# EAGLE design Focuser (EAGLE 7.0.0)
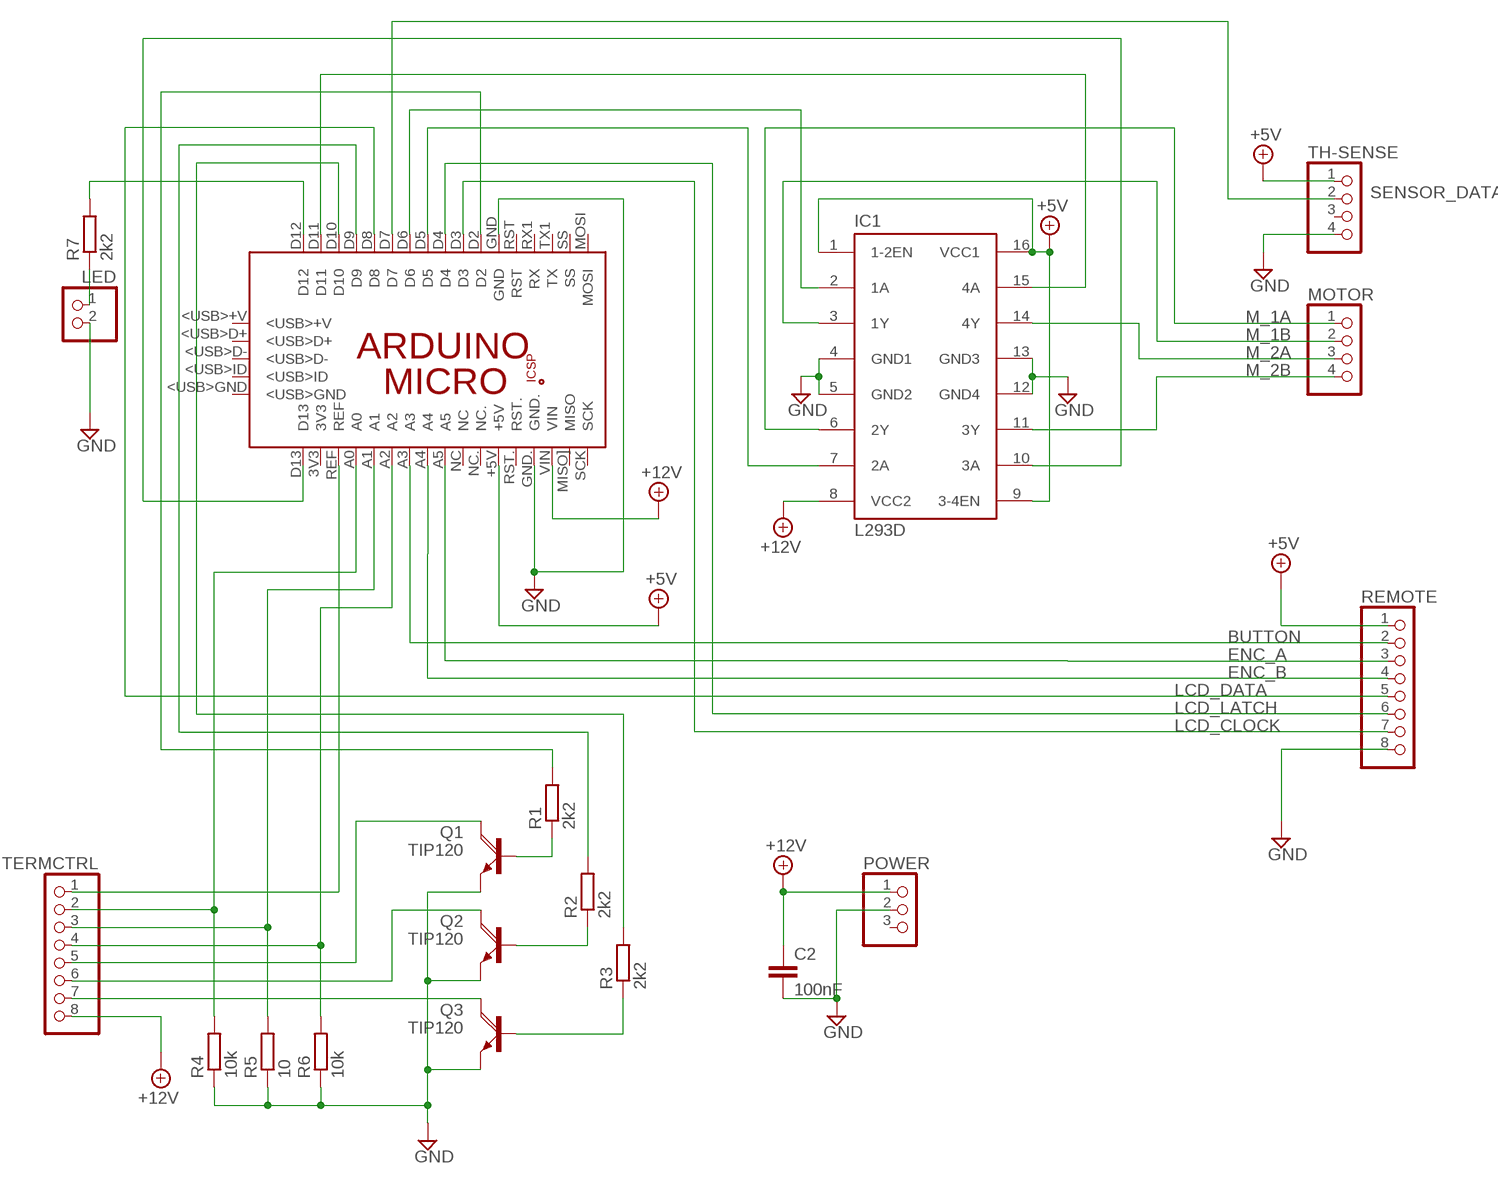
[diagram p0: schematic, sheet 1]

## Parts
C2  100nF  C-EU025_050-025X075  [C025_050-025X075]
IC1  L293D  [DIL16]
LED  PINHD-1X2  [1X02]
MOTOR  PINHD-1X4  [1X04]
PCB1  ARDUINO_MICRO  [ARDUINO_MICRO]
POWER  PINHD-1X3  [1X03]
Q1  TIP120  [TO220AH]
Q2  TIP120  [TO220AH]
Q3  TIP120  [TO220AH]
R1  2k2  R-EU_0207/7  [0207/7]
R2  2k2  R-EU_0207/7  [0207/7]
R3  2k2  R-EU_0207/7  [0207/7]
R4  10k  R-EU_0207/7  [0207/7]
R5  10  R-EU_0207/7  [0207/7]
R6  10k  R-EU_0207/7  [0207/7]
R7  2k2  R-EU_0207/7  [0207/7]
REMOTE  PINHD-1X8  [1X08]
TERMCTRL  PINHD-1X8  [1X08]
TH-SENSE  PINHD-1X4  [1X04]

## Nets
+5V [Power]: IC1.1(1-2EN) IC1.9(3-4EN) IC1.16(VCC1) PCB1.+5V REMOTE.1 TH-SENSE.1
+12V [Power]: C2.1 IC1.8(VCC2) PCB1.VIN POWER.1 TERMCTRL.8
BUTTON: PCB1.A3 REMOTE.2
ENC_A: PCB1.A5 REMOTE.3
ENC_B: PCB1.A4 REMOTE.4
GND [Power]: C2.2 IC1.4(GND1) IC1.5(GND2) IC1.12(GND4) IC1.13(GND3) LED.2 PCB1.GND PCB1.GND. POWER.2 Q1.E Q2.E Q3.E R4.1 R5.1 R6.1 REMOTE.8 TH-SENSE.4
LCD_CLOCK: PCB1.D3 REMOTE.7
LCD_DATA: PCB1.D8 REMOTE.5
LCD_LATCH: PCB1.D4 REMOTE.6
M_1A: IC1.6(2Y) MOTOR.1
M_1B: IC1.3(1Y) MOTOR.2
M_2A: IC1.14(4Y) MOTOR.3
M_2B: IC1.11(3Y) MOTOR.4
N$1: PCB1.A2 R6.2 TERMCTRL.4
N$2: PCB1.A0 R4.2 TERMCTRL.2
N$3: PCB1.A1 R5.2 TERMCTRL.3
N$4 [HalfPower]: Q3.C TERMCTRL.7
N$5 [HalfPower]: Q2.C TERMCTRL.6
N$6 [HalfPower]: Q1.C TERMCTRL.5
N$7: PCB1.D2 R1.2
N$9: IC1.2(1A) PCB1.D6
N$10: IC1.7(2A) PCB1.D5
N$11: IC1.15(4A) PCB1.D11
N$12: LED.1 R7.1
N$13: IC1.10(3A) PCB1.D13
N$14: PCB1.D12 R7.2
N$15: Q3.B R3.1
N$16: Q2.B R2.1
N$19: Q1.B R1.1
N$21: PCB1.D9 R2.2
N$22: PCB1.D10 R3.2
N$23: PCB1.REF TERMCTRL.1
SENSOR_DATA: PCB1.D7 TH-SENSE.2
Unconnected: PCB1.3V3 PCB1.5V PCB1.<USB>+V PCB1.<USB>D+ PCB1.<USB>D- PCB1.<USB>GND PCB1.<USB>ID PCB1.GND_ PCB1.MISO. PCB1.MISO](MISO) PCB1.MOSI PCB1.MOSI. PCB1.NC PCB1.NC. PCB1.RESET.. PCB1.RST PCB1.RST. PCB1.RX1(RX) PCB1.SCK PCB1.SCK. PCB1.SS PCB1.TX1(TX) POWER.3 TH-SENSE.3

## Library data of the parts
C2 = rcl:C-EU: CAPACITOR, European symbol
IC1 = st-microelectronics:L293D: PUSH-PULL 4 CHANNEL DRIVER; MPN: L293D; OC_FARNELL: 9589619; OC_NEWARK: 56P8249
LED = pinhead:PINHD-1X2: PIN HEADER
MOTOR TH-SENSE = pinhead:PINHD-1X4: PIN HEADER
PCB1 = E14_Arduino:ARDUINO_MICRO: Device for representing an Arduino Micro board with a footprint in an EAGLE design. Created by Dave Young for Element14. More EAGLE documentation at: http://www.element14.com/community/community/knode/cadsoft_eagle
POWER = pinhead:PINHD-1X3: PIN HEADER
Q1-Q3 = transistor-power:TIP120: NPN DARLINGTON TRANSISTOR
R1-R7 = resistor:R-EU_: RESISTOR, European symbol
REMOTE TERMCTRL = pinhead:PINHD-1X8: PIN HEADER

## Net classes
1 Power: width 0.813 mm, clearance 0.406 mm
2 HalfPower: width 0.61 mm, clearance 0.61 mm

## Board
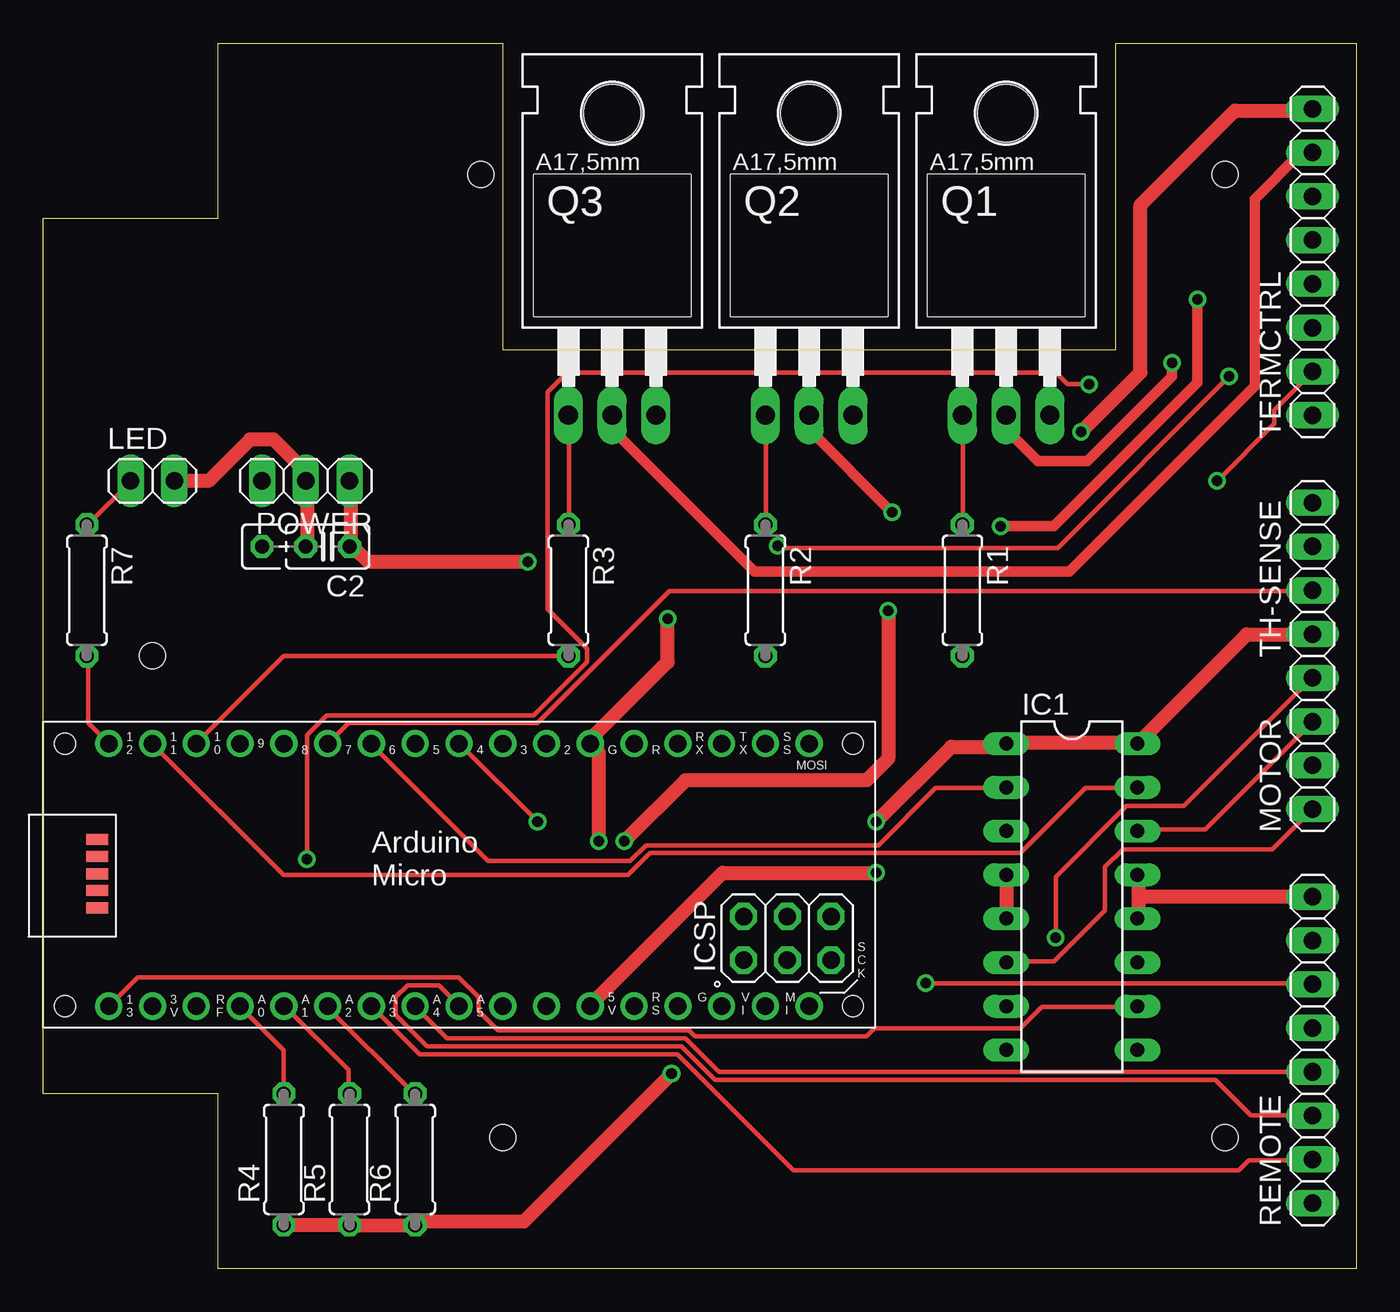
[diagram p1: board, top side]
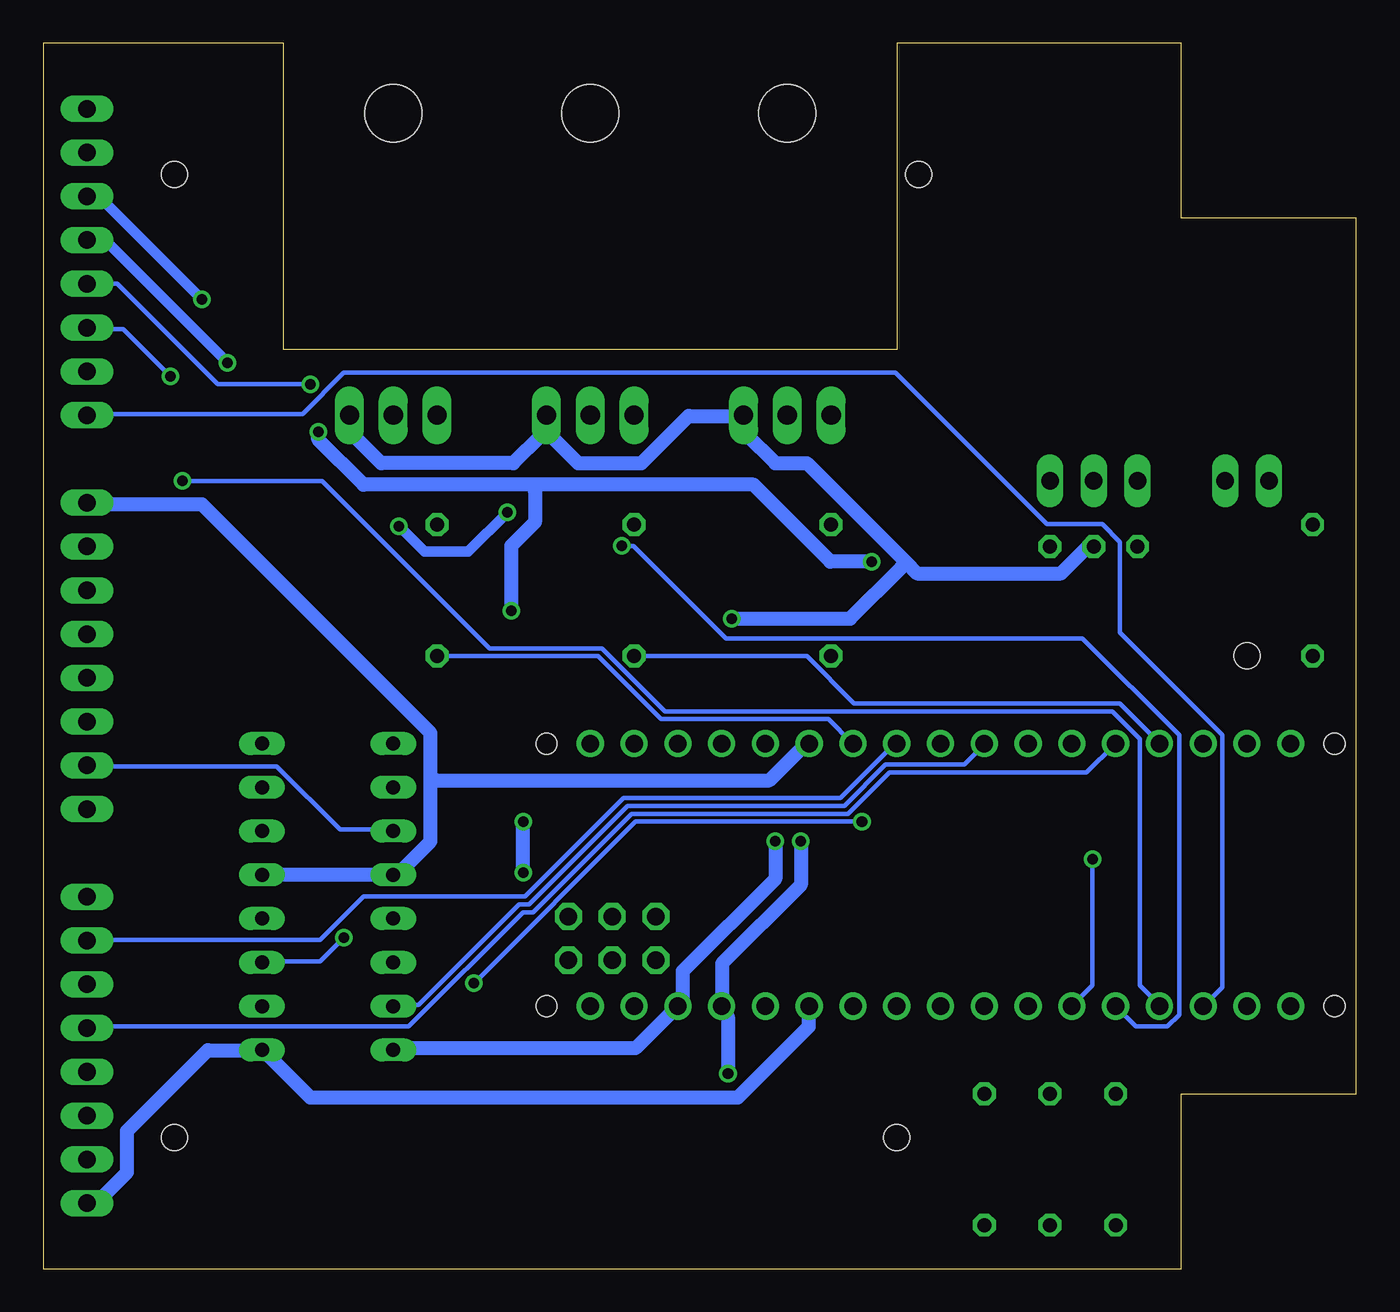
[diagram p2: board, bottom side, seen from below]

Size 76.2 x 71.12 mm. Coordinates in mm from the lower left corner, seen from the top.
Outline: 0,60.96 10.16,60.96 10.16,71.12 26.67,71.12 26.67,53.34 62.23,53.34 62.23,71.12 76.2,71.12 76.2,0 10.16,0 10.16,10.16 0,10.16 0,60.96
Copper layers (1*16): Top 0.035mm / dielectric 1.5mm / Bottom 0.035mm
Design rules "default": minimum track width 10mil, minimum drill 24mil, track to track 8mil, track to pad 8mil, pad to pad 8mil, via to via 8mil, smd to smd 8mil, copper to edge 40mil, drill to drill 8mil, minimum pad ring 10mil, minimum via ring 8mil, stop-mask expansion 4mil, vias tented up to drill 0mil, thermal gap 10mil
Holes 1.5 mm at 25.4,63.5 68.58,63.5 68.58,7.62 26.67,7.62 6.35,35.56

### Footprints (pad centres in the part's own frame; a part is rotated, then mirrored left to right if it is on the bottom)
C025_050-025X075 = drill 0.813 octagon: 1 -1.27,0; 2 1.27,0; 3 3.81,0
DIL16 = drill 0.813 long: 1 -8.89,-3.81; 2 -6.35,-3.81; 3 -3.81,-3.81; 4 -1.27,-3.81; 5 1.27,-3.81; 6 3.81,-3.81; 7 6.35,-3.81; 8 8.89,-3.81; 9 8.89,3.81; 10 6.35,3.81; 11 3.81,3.81; 12 1.27,3.81; 13 -1.27,3.81; 14 -3.81,3.81; 15 -6.35,3.81; 16 -8.89,3.81
1X02 = drill 1.016 long: 1 -1.27,0; 2 1.27,0
1X04 = drill 1.016 long: 1 -3.81,0; 2 -1.27,0; 3 1.27,0; 4 3.81,0
ARDUINO_MICRO = drill 1.016 pad 1.575: 3V3 6.35,1.27; +5V 31.75,1.27; A0 11.43,1.27; A1 13.97,1.27; A2 16.51,1.27; A3 19.05,1.27; A4 21.59,1.27; A5 24.13,1.27; D2 29.21,16.51; D3 26.67,16.51; D4 24.13,16.51; D5 21.59,16.51; D6 19.05,16.51; D7 16.51,16.51; D8 13.97,16.51; D9 11.43,16.51; D10 8.89,16.51; D11 6.35,16.51; D12 3.81,16.51; D13 3.81,1.27; GND 31.75,16.51; GND. 36.83,1.27; MISO] 41.91,1.27; MOSI 44.45,16.51; NC 26.67,1.27; NC. 29.21,1.27; REF 8.89,1.27; RST 34.29,16.51; RST. 34.29,1.27; RX1 36.83,16.51; SCK 44.45,1.27; SS 41.91,16.51; TX1 39.37,16.51; VIN 39.37,1.27 | drill 1.016 pad 1.575 octagon: 5V 40.64,6.477; GND_ 45.72,6.477; MISO. 40.64,3.937; MOSI. 43.18,6.477; RESET.. 45.72,3.937; SCK. 43.18,3.937 | smd 1.27 x 0.635: <USB>+V 3.15,10.947; <USB>D+ 3.15,9.957; <USB>D- 3.15,8.941; <USB>GND 3.15,6.96; <USB>ID 3.15,7.976 | hole 1.2: 1.27,1.27; 1.27,16.51; 46.99,16.51; 46.99,1.27
1X03 = drill 1.016 long: 1 -2.54,0; 2 0,0; 3 2.54,0
TO220AH = drill 1.118 long: B -2.54,-6.35; C 0,-6.35; E 2.54,-6.35 | hole 3.302: 0,11.176
0207/7 = drill 0.813 octagon: 1 -3.81,0; 2 3.81,0
1X08 = drill 1.016 long: 1 -8.89,0; 2 -6.35,0; 3 -3.81,0; 4 -1.27,0; 5 1.27,0; 6 3.81,0; 7 6.35,0; 8 8.89,0

### Placement (x,y rotation side)
C2  16.51,41.91 180 top
IC1  59.69,21.59 270 top
LED  6.35,45.72 0 top
MOTOR  73.66,30.48 90 top
PCB1  0,13.97 0 top
POWER  15.24,45.72 180 top
Q1  55.88,55.88 0 top
Q2  44.45,55.88 0 top
Q3  33.02,55.88 0 top
R1  53.34,39.37 270 top
R2  41.91,39.37 270 top
R3  30.48,39.37 270 top
R4  13.97,6.35 90 top
R5  17.78,6.35 90 top
R6  21.59,6.35 90 top
R7  2.54,39.37 270 top
REMOTE  73.66,12.7 90 top
TERMCTRL  73.66,58.42 90 top
TH-SENSE  73.66,40.64 90 top

### Tracks (layer width: path | path; a pad name or v marks a point on that pad's centre or on a via)
+5V  (via drill 0.61)
  Top 0.813: TH-SENSE.1 73.61,36.8 69.84,36.8 63.78,30.75 IC1.16 63.44,30.52 55.89,30.52 IC1.1 55.55,30.29 52.69,30.29 v48.35,25.95 | v48.35,22.97 39.43,22.97 31.77,15.32 PCB1.+5V
  Bottom 0.813: REMOTE.1 73.61,3.89 73.04,3.89 71.32,5.6 71.32,8 66.64,12.69 63.55,12.69 IC1.9 63.21,12.46 60.69,9.94 35.89,9.94 31.77,14.06 31.77,15.2 PCB1.+5V | v48.35,22.97 v48.35,25.95
+12V  (via drill 0.61)
  Top 0.813: POWER.1 17.83,45.72 17.83,41.95 C2.1 18.17,41.72 18.86,41.03 v28.12,41.03 | v60.24,48.58 63.66,52.01 63.66,61.72 69.15,67.21 73.61,67.21 TERMCTRL.8 | v33.72,24.8 37.26,28.35 47.78,28.35 49.03,29.6 v49.03,38.18
  Bottom 0.813: IC1.8 55.78,12.8 41.83,12.8 39.43,15.2 PCB1.VIN 39.09,15.54 39.09,17.26 33.72,22.63 v33.72,24.8 | v60.24,48.58 60.24,48.12 57.61,45.49 47.66,45.49 | 47.66,45.49 34.98,45.49 30.52,41.03 v28.12,41.03 | v49.03,38.18 49.03,41.95 47.66,43.32 47.66,45.15 47.66,45.49
BUTTON
  Top 0.254: REMOTE.2 73.61,6.29 69.95,6.29 69.38,5.71 43.55,5.71 36.8,12.46 21.83,12.46 19.09,15.2 PCB1.A3
ENC_A
  Top 0.254: REMOTE.3 73.61,8.91 70.07,8.91 68.01,10.97 38.98,10.97 37.03,12.92 22.29,12.92 20.46,14.74 20.46,15.77 21.14,16.46 22.97,16.46 24.12,15.32 PCB1.A5
ENC_B
  Top 0.254: REMOTE.4 73.61,11.43 39.2,11.43 37.26,13.37 23.43,13.37 21.6,15.2 PCB1.A4
GND  (via drill 0.61)
  Top 0.813: C2.2 15.32,41.95 15.32,45.72 POWER.2 15.09,46.06 15.09,46.41 13.37,48.12 12,48.12 9.6,45.72 7.66,45.72 LED.2 | 63.55,21.6 63.55,22.86 IC1.13 | 63.55,21.6 63.55,20.34 IC1.12 | REMOTE.8 73.61,21.6 63.89,21.6 63.55,21.6 | R4.1 14.06,2.52 17.72,2.52 R5.1 18.17,2.52 21.49,2.52 R6.1 21.95,2.74 27.89,2.74 v36.46,11.32 | IC1.5 55.89,20.34 55.89,22.86 IC1.4 | v32.23,24.8 32.23,29.95 31.77,30.4 PCB1.GND 31.89,30.86 36.23,35.2 v36.23,37.72
  Bottom 0.813: Q1.E 58.41,49.49 58.41,48.58 56.58,46.75 48.92,46.75 47.32,48.35 Q2.E 46.98,49.49 46.98,48.58 45.15,46.75 41.49,46.75 38.75,49.49 35.66,49.49 Q3.E 35.43,49.15 35.43,48.46 33.72,46.75 31.89,46.75 26.12,40.98 | 26.12,40.98 25.49,40.35 17.14,40.35 15.66,41.83 15.32,41.83 C2.2 | 53.72,28.35 53.72,24.8 55.66,22.86 55.78,22.86 IC1.4 56.24,22.86 63.44,22.86 IC1.13 | 53.72,28.35 53.72,31.09 66.98,44.35 73.61,44.35 TH-SENSE.4 | PCB1.GND 31.77,30.4 32,30.4 34.06,28.35 53.38,28.35 53.72,28.35 | v32.23,24.8 32.23,22.29 36.8,17.72 36.8,15.32 PCB1.GND. 36.69,14.86 36.46,14.63 v36.46,11.32 | v36.23,37.72 29.38,37.72 26.4,40.69 26.12,40.98
LCD_CLOCK
  Bottom 0.254: REMOTE.7 73.61,19.09 60.12,19.09 57.61,21.6 48.23,21.6 42.52,27.32 29.95,27.32 26.75,30.52 PCB1.D3
LCD_DATA
  Bottom 0.254: REMOTE.5 73.61,14.06 54.98,14.06 48.35,20.69 47.78,20.69 42.06,26.4 29.49,26.4 27.09,28.8 15.66,28.8 14.06,30.4 PCB1.D8
LCD_LATCH  (via drill 0.61)
  Top 0.254: v51.21,16.57 73.61,16.57 REMOTE.6 | v28.69,25.95 24.23,30.4 PCB1.D4
  Bottom 0.254: v51.21,16.57 41.83,25.95 v28.69,25.95
M_1A
  Top 0.254: IC1.6 55.89,17.83 58.64,17.83 61.61,20.8 61.61,23.32 62.64,24.35 71.32,24.35 73.61,26.63 MOTOR.1
M_1B
  Bottom 0.254: IC1.3 55.89,25.49 58.98,25.49 62.64,29.15 73.61,29.15 MOTOR.2
M_2A
  Top 0.254: IC1.14 63.55,25.49 67.44,25.49 73.61,31.66 MOTOR.3
M_2B  (via drill 0.61)
  Top 0.254: v58.75,19.2 58.75,22.75 62.87,26.86 66.18,26.86 73.61,34.29 MOTOR.4
  Bottom 0.254: v58.75,19.2 60.12,17.83 63.44,17.83 IC1.11
N$1  (via drill 0.61)
  Top 0.254: R6.2 21.49,10.17 16.46,15.2 PCB1.A2 | v60.69,51.32 59.44,51.32 58.75,52.01 30.4,52.01 29.26,50.86 29.26,38.29 31.55,36.01 31.55,35.2 28.46,32.12 16.46,32.12 15.32,30.98 v15.32,23.77
  Bottom 0.254: v60.69,51.32 66.06,51.32 71.89,57.15 73.61,57.15 TERMCTRL.4 | v15.32,23.77 15.32,16.46 16.46,15.32 PCB1.A2
N$2  (via drill 0.61)
  Top 0.254: R4.2 13.95,10.17 13.95,12.69 11.43,15.2 PCB1.A0 | v68.12,45.72 71.44,49.03 71.44,49.84 73.61,52.01 TERMCTRL.2
  Bottom 0.254: v68.12,45.72 60.01,45.72 50.29,36.01 43.78,36.01 40.12,32.35 14.17,32.35 12.57,30.75 12.57,16.46 11.43,15.32 PCB1.A0
N$3  (via drill 0.61)
  Top 0.254: R5.2 17.72,10.17 17.72,11.54 14.06,15.2 PCB1.A1 | v68.81,51.78 58.86,41.83 42.75,41.83 v42.63,41.95
  Bottom 0.254: v68.81,51.78 71.55,54.52 73.61,54.52 TERMCTRL.3 | v42.63,41.95 41.95,41.95 36.58,36.58 15.89,36.58 10.29,30.98 10.29,14.74 10.97,14.06 12.8,14.06 13.95,15.2 PCB1.A1
N$4
  Top 0.61: TERMCTRL.7 73.61,64.69 72.92,64.69 70.29,62.06 70.29,51.21 59.55,40.46 41.26,40.46 33.03,48.69 33.03,49.49 Q3.C
N$5  (via drill 0.61)
  Top 0.61: v66.98,56.24 66.98,51.44 58.64,43.09 v55.55,43.09 | v49.26,43.89 44.46,48.69 44.46,49.49 Q2.C
  Bottom 0.61: v66.98,56.24 72.92,62.18 73.61,62.18 TERMCTRL.6 | v55.55,43.09 54.06,41.6 51.55,41.6 v49.26,43.89
N$6  (via drill 0.61)
  Top 0.61: v65.49,52.58 65.49,51.78 60.58,46.86 57.72,46.86 55.89,48.69 55.89,49.49 Q1.C
  Bottom 0.61: v65.49,52.58 72.58,59.66 73.61,59.66 TERMCTRL.5
N$7
  Bottom 0.254: R1.2 53.26,35.55 44.01,35.55 40.35,31.89 30.63,31.89 29.26,30.52 PCB1.D2
N$9
  Top 0.254: IC1.2 55.78,27.89 51.78,27.89 48.46,24.57 34.98,24.57 34.06,23.66 25.83,23.66 19.09,30.4 PCB1.D6
N$10
  Bottom 0.254: IC1.7 55.78,15.32 54.41,15.32 48.58,21.14 48.01,21.14 42.29,26.86 29.72,26.86 27.32,29.26 22.75,29.26 21.6,30.4 PCB1.D5
N$11
  Top 0.254: IC1.15 63.44,27.89 60.47,27.89 56.69,24.12 35.2,24.12 33.95,22.86 13.95,22.86 6.4,30.4 PCB1.D11
N$12
  Top 0.254: R7.1 2.63,43.2 5.14,45.72 LED.1
N$13
  Top 0.254: IC1.10 63.44,15.2 57.95,15.2 56.69,13.95 48.23,13.95 47.78,13.49 37.83,13.49 37.49,13.83 26.4,13.83 25.26,14.97 25.26,15.77 24.12,16.92 5.49,16.92 3.89,15.32 PCB1.D13
N$14
  Top 0.254: R7.2 2.63,35.55 2.63,31.66 3.77,30.52 PCB1.D12
N$15
  Top 0.254: R3.1 30.52,43.2 30.52,49.49 Q3.B
N$16
  Top 0.254: R2.1 41.95,43.2 41.95,49.49 Q2.B
N$19
  Top 0.254: R1.1 53.38,43.2 53.38,49.49 Q1.B
N$21
  Bottom 0.254: R2.2 41.83,35.55 31.89,35.55 29.15,32.8 13.72,32.8 11.43,30.52 PCB1.D9
N$22
  Top 0.254: R3.2 30.4,35.55 13.95,35.55 8.91,30.52 PCB1.D10
N$23
  Bottom 0.254: TERMCTRL.1 73.61,49.61 61.15,49.61 58.75,52.01 26.75,52.01 17.95,43.2 14.74,43.2 13.72,42.18 13.72,36.92 7.77,30.98 7.77,16.34 8.8,15.32 PCB1.REF
SENSOR_DATA
  Top 0.254: TH-SENSE.2 73.61,39.32 36.35,39.32 28.69,31.66 17.72,31.66 16.57,30.52 PCB1.D7